# Altium project AdapterBoard.PrjPcb
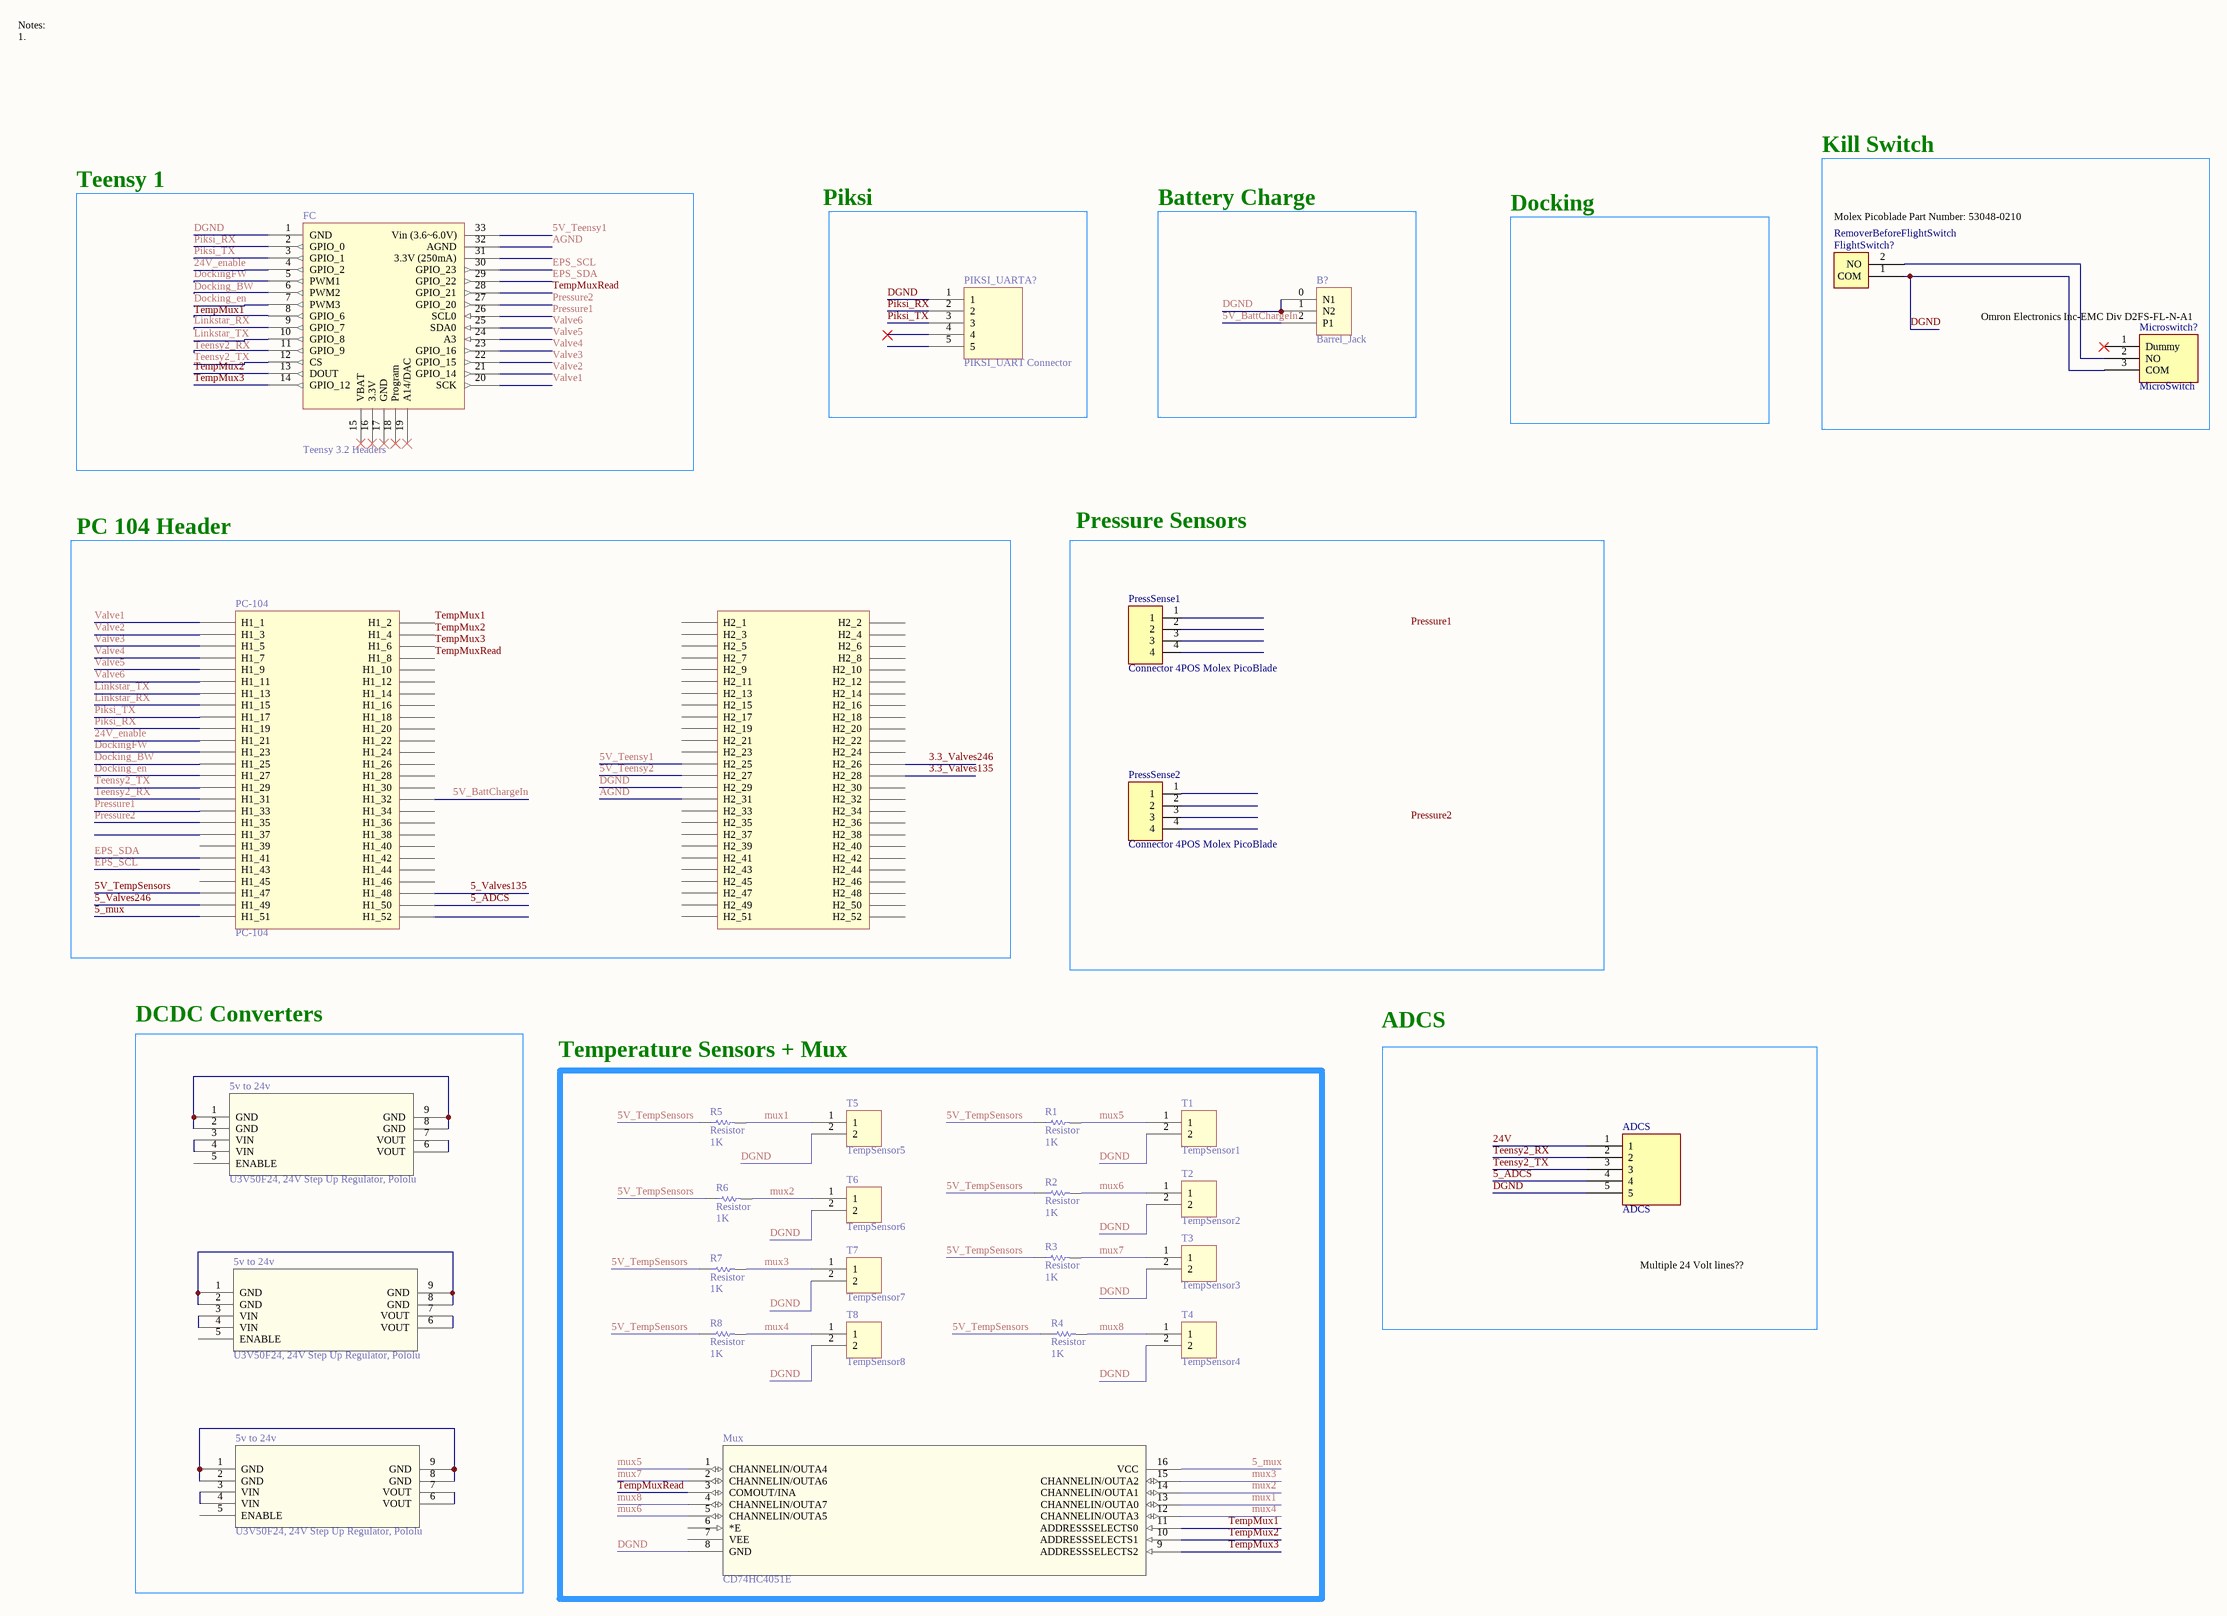
[diagram p0: AdapterBoard.SchDoc]
1 sheet, 29 parts. Net scope: global (net labels, ports and power ports of the same name join across sheets).
Board file: AdapterBoard.PcbDoc

## Sheet AdapterBoard.SchDoc
size C

### Parts
(Parts that share a designator on the sheet are numbered #1, #2 ... from top to bottom, then left to right.)
5v_to_24v#1  U3V50F24, 24V Step Up Regulator, Pololu  [U3V50F24]
5v_to_24v#2  U3V50F24, 24V Step Up Regulator, Pololu  [U3V50F24]
5v_to_24v#3  U3V50F24, 24V Step Up Regulator, Pololu  [U3V50F24]
ADCS  ADCS  [Molex Picoblade 5 Pin]
B?  Barrel_Jack  [Barrel_Jack]
FC  Teensy 3.2 Headers  [Teensy 3.2 SMD Headers]
FlightSwitch?  RemoverBeforeFlightSwitch  [RemoverBeforeFlight Switch]
Microswitch?  MicroSwitch  [MicroSwitch_3pin]
Mux  CD74HC4051E  [N16]
PC-104  PC-104  [PC-104FOOTPRINT]
PIKSI_UARTA?  PIKSI_UART Connector  [Molex Picoblade 5 Pin]
PressSense1  Connector 4POS Molex PicoBlade  [532610471]
PressSense2  Connector 4POS Molex PicoBlade  [532610471]
R1  Resistor  value 1K  [AXIAL-0.3]
R2  Resistor  value 1K  [AXIAL-0.3]
R3  Resistor  value 1K  [AXIAL-0.3]
R4  Resistor  value 1K  [AXIAL-0.3]
R5  Resistor  value 1K  [AXIAL-0.3]
R6  Resistor  value 1K  [AXIAL-0.3]
R7  Resistor  value 1K  [AXIAL-0.3]
R8  Resistor  value 1K  [AXIAL-0.3]
T1  TempSensor1  [RemoverBeforeFlight Switch]
T2  TempSensor2  [RemoverBeforeFlight Switch]
T3  TempSensor3  [RemoverBeforeFlight Switch]
T4  TempSensor4  [RemoverBeforeFlight Switch]
T5  TempSensor5  [RemoverBeforeFlight Switch]
T6  TempSensor6  [RemoverBeforeFlight Switch]
T7  TempSensor7  [RemoverBeforeFlight Switch]
T8  TempSensor8  [RemoverBeforeFlight Switch]

### Blocks framed on the sheet
Kill Switch: FlightSwitch? Microswitch?
Teensy 1: FC
Battery Charge: B?
PC 104 Header: PC-104
Pressure Sensors: PressSense1 PressSense2
DCDC Converters: 5v_to_24v#1-5v_to_24v#3
ADCS: ADCS
Temperature Sensors + Mux: Mux R1-R8 T1-T8

### Nets
3.3_Valves135: PC-104.H2_28
3.3_Valves246: PC-104.H2_26
5_ADCS: ADCS.4 PC-104.H1_50
5_mux: Mux.16(VCC) PC-104.H1_51
5_Valves135: PC-104.H1_48
5_Valves246: PC-104.H1_49
5V_BattChargeIn: B?.2(P1) PC-104.H1_32
5V_Teensy1: FC.33(Vin_(3.6~6.0V)) PC-104.H2_25
5V_Teensy2: PC-104.H2_27
5V_TempSensors: PC-104.H1_47 R1.1 R2.1 R3.1 R4.1 R5.1 R6.1 R7.1 R8.1
24V: ADCS.1
24V_enable: FC.4(GPIO_2) PC-104.H1_21
AGND: FC.32(AGND) PC-104.H2_31
DGND: ADCS.5 B?.0(N1) B?.1(N2) FC.1(GND) FlightSwitch?.1(COM) Microswitch?.3(COM) Mux.8(GND) PC-104.H2_29 PIKSI_UARTA?.1 T1.2 T2.2 T3.2 T4.2 T5.2 T6.2 T7.2 T8.2
Docking_BW: FC.6(PWM2) PC-104.H1_25
Docking_en: FC.7(PWM3) PC-104.H1_27
DockingFW: FC.5(PWM1) PC-104.H1_23
EPS_SCL: FC.30(GPIO_23) PC-104.H1_43
EPS_SDA: FC.29(GPIO_22) PC-104.H1_41
Linkstar_RX: FC.9(GPIO_7) PC-104.H1_15
Linkstar_TX: FC.10(GPIO_8) PC-104.H1_13
mux1: Mux.13(CHANNELIN/OUTA0) R5.2 T5.1
mux2: Mux.14(CHANNELIN/OUTA1) R6.2 T6.1
mux3: Mux.15(CHANNELIN/OUTA2) R7.2 T7.1
mux4: Mux.12(CHANNELIN/OUTA3) R8.2 T8.1
mux5: Mux.1(CHANNELIN/OUTA4) R1.2 T1.1
mux6: Mux.5(CHANNELIN/OUTA5) R2.2 T2.1
mux7: Mux.2(CHANNELIN/OUTA6) R3.2 T3.1
mux8: Mux.4(CHANNELIN/OUTA7) R4.2 T4.1
Piksi_RX: FC.2(GPIO_0) PC-104.H1_19 PIKSI_UARTA?.2
Piksi_TX: FC.3(GPIO_1) PC-104.H1_17 PIKSI_UARTA?.3
Pressure1: FC.26(SCL0) PC-104.H1_33
Pressure2: FC.27(GPIO_20) PC-104.H1_35
Teensy2_RX: ADCS.2 FC.11(GPIO_9) PC-104.H1_31
Teensy2_TX: ADCS.3 FC.12(CS) PC-104.H1_29
TempMux1: FC.8(GPIO_6) Mux.11(ADDRESSSELECTS0) PC-104.H1_2
TempMux2: FC.13(DOUT) Mux.10(ADDRESSSELECTS1) PC-104.H1_4
TempMux3: FC.14(GPIO_12) Mux.9(ADDRESSSELECTS2) PC-104.H1_6
TempMuxRead: FC.28(GPIO_21) Mux.3(COMOUT/INA) PC-104.H1_8
Valve1: FC.20(SCK) PC-104.H1_1
Valve2: FC.21(GPIO_14) PC-104.H1_3
Valve3: FC.22(GPIO_15) PC-104.H1_5
Valve4: FC.23(GPIO_16) PC-104.H1_7
Valve5: FC.24(A3) PC-104.H1_9
Valve6: FC.25(SDA0) PC-104.H1_11
Net5v_to_24v#1_1: 5v_to_24v#1.1(GND) 5v_to_24v#1.2(GND) 5v_to_24v#1.8(GND) 5v_to_24v#1.9(GND)
Net5v_to_24v#1_3: 5v_to_24v#1.3(VIN) 5v_to_24v#1.4(VIN)
Net5v_to_24v#1_6: 5v_to_24v#1.6(VOUT) 5v_to_24v#1.7(VOUT)
Net5v_to_24v#2_1: 5v_to_24v#2.1(GND) 5v_to_24v#2.2(GND) 5v_to_24v#2.8(GND) 5v_to_24v#2.9(GND)
Net5v_to_24v#2_3: 5v_to_24v#2.3(VIN) 5v_to_24v#2.4(VIN)
Net5v_to_24v#3_1: 5v_to_24v#3.1(GND) 5v_to_24v#3.2(GND) 5v_to_24v#3.8(GND) 5v_to_24v#3.9(GND)
Net5v_to_24v#3_3: 5v_to_24v#3.3(VIN) 5v_to_24v#3.4(VIN)
Net5v_to_24v#3_6: 5v_to_24v#3.6(VOUT) 5v_to_24v#3.7(VOUT)
NetFlightSwitch?_2: FlightSwitch?.2(NO) Microswitch?.2(NO)

Not connected (* = marked no-connect by the designer): 5v_to_24v#1 5(ENABLE); 5v_to_24v#2 5(ENABLE) 6(VOUT) 7(VOUT); 5v_to_24v#3 5(ENABLE); FC 15(VBAT)* 16(3.3V)* 17(GND)* 18(Program)* 19(A14/DAC)* 31(3.3V_(250mA)); Microswitch? 1(Dummy)*; Mux 6(*E) 7(VEE); PC-104 H1_10 H1_12 H1_14 H1_16 H1_18 H1_20 H1_22 H1_24 H1_26 H1_28 H1_30 H1_34 H1_36 H1_37 H1_38 H1_39 H1_40 H1_42 H1_44 H1_45 H1_46 H1_52 H2_1 H2_2 H2_3 H2_4 H2_5 H2_6 H2_7 H2_8 H2_9 H2_10 H2_11 H2_12 H2_13 H2_14 H2_15 H2_16 H2_17 H2_18 H2_19 H2_20 H2_21 H2_22 H2_23 H2_24 H2_30 H2_32 H2_33 H2_34 H2_35 H2_36 H2_37 H2_38 H2_39 H2_40 H2_41 H2_42 H2_43 H2_44 H2_45 H2_46 H2_47 H2_48 H2_49 H2_50 H2_51 H2_52; PIKSI_UARTA? 4* 5; PressSense1 1 2 3 4; PressSense2 1 2 3 4

### Notes on the sheet
- Notes:
  1.
- Piksi
- Docking
- (near FlightSwitch?) Molex Picoblade Part Number: 53048-0210
- (near Microswitch?) Omron Electronics Inc-EMC Div D2FS-FL-N-A1
- Multiple 24 Volt lines??
- Labels drawn without touching a wire or pin: Pressure1, Pressure2

### Library data of the parts
5v_to_24v#1-5v_to_24v#3 = U3V50F24, 24V Step Up Regulator, Pololu: 4V Step Up Regulator
ADCS PIKSI_UARTA? = PIKSI_UART Connector: Molex Picoblade 53261-0571
FlightSwitch? T1-T8 = RemoverBeforeFlightSwitch: 53048-0210 Molex Picoblade
Microswitch? = MicroSwitch: Omron Electronics Inc-EMC Div D2FS-FL-N-A1
Mux = CD74HC4051E: Imported; Vendor: Texas Instruments; Section: Unknown; C: Copyright (C) 2015 Accelerated Designs. All rights reserved; Manufacturer_Part_Number: CD74HC4051E; Family: Unknown; Manufacturer_Name: Texas Instruments; Copyright: Copyright (C) 2015 Accelerated Designs. All rights reserved; RS_Part_Number: 526694; Value: Value; Type: Type; RefDes: RefDes
PC-104 = PC-104: ESQ-126-14-G-D (2 total needed)
PressSense1 PressSense2 = 532610471
R1-R8 = Res1: Published: 8-Jun-2000; LatestRevisionDate: 17-Jul-2002; LatestRevisionNote: Re-released for DXP Platform.; PackageReference: AXIAL-0.3; Publisher: Altium Limited; PackageDescription: Axial Device, Thru-Hole; 2 Leads; 0.3 in Pin Spacing